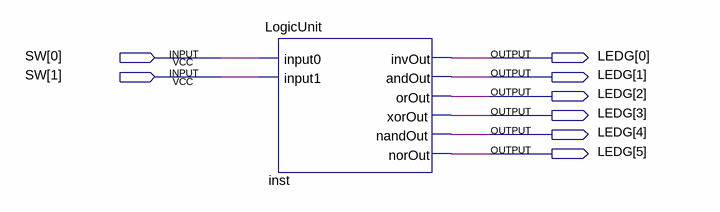
[diagram p0: schematic sheet]
// Quartus schematic LogicTop.bdf as structural Verilog: 1 symbols, 8 pins
module LogicTop (
  input  [1:0] SW,
  output [5:0] LEDG
);

  LogicUnit inst (
    .input0(SW[0]), .input1(SW[1]), .invOut(LEDG[0]), .andOut(LEDG[1]), .orOut(LEDG[2]), .xorOut(LEDG[3]),
    .nandOut(LEDG[4]), .norOut(LEDG[5]));
endmodule
